# Altium schematic sheet 03_EFR32xG1x_DISC_REF_DES_A00_Efr32Signal.SchDoc
size 420 x 297 mm
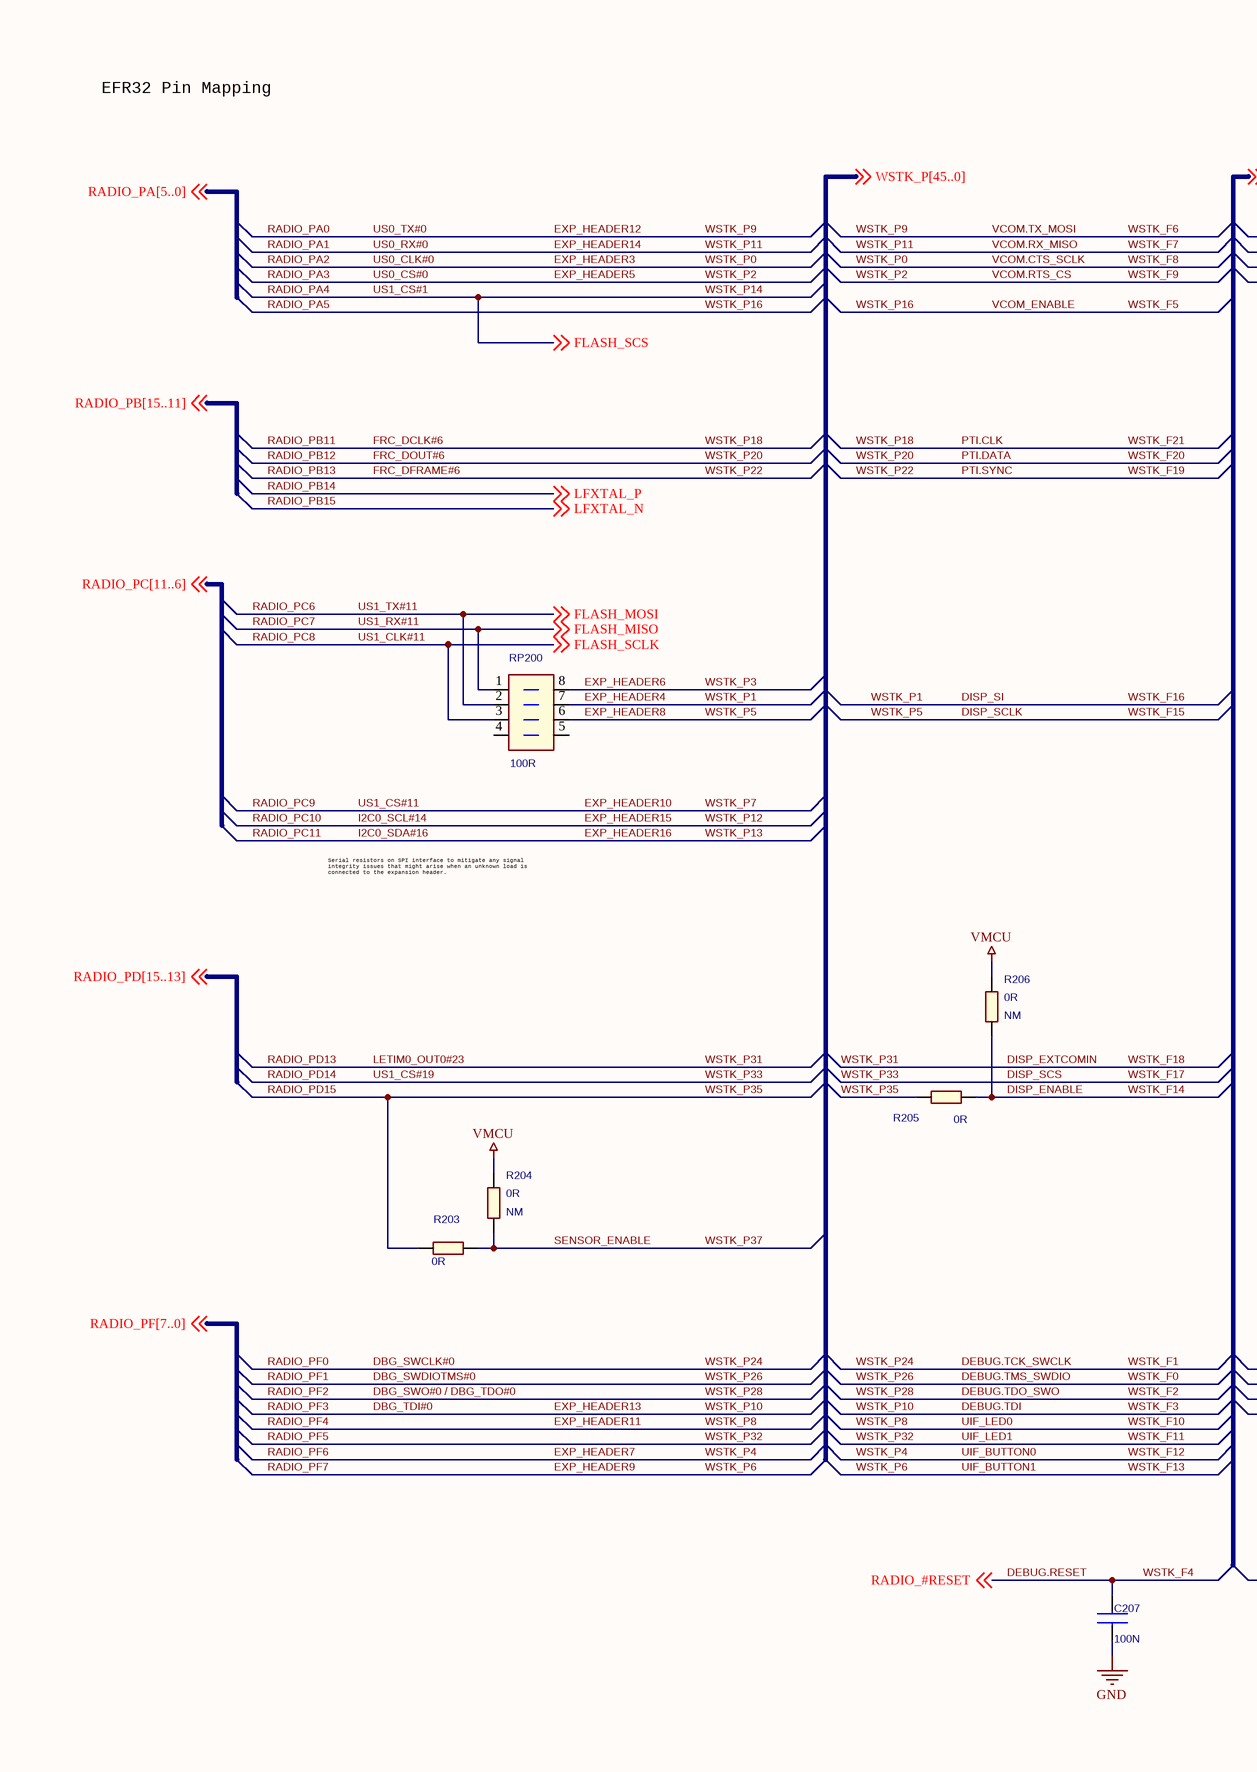
[diagram p0: 03_EFR32xG1x_DISC_REF_DES_A00_Efr32Signal.SchDoc, left]
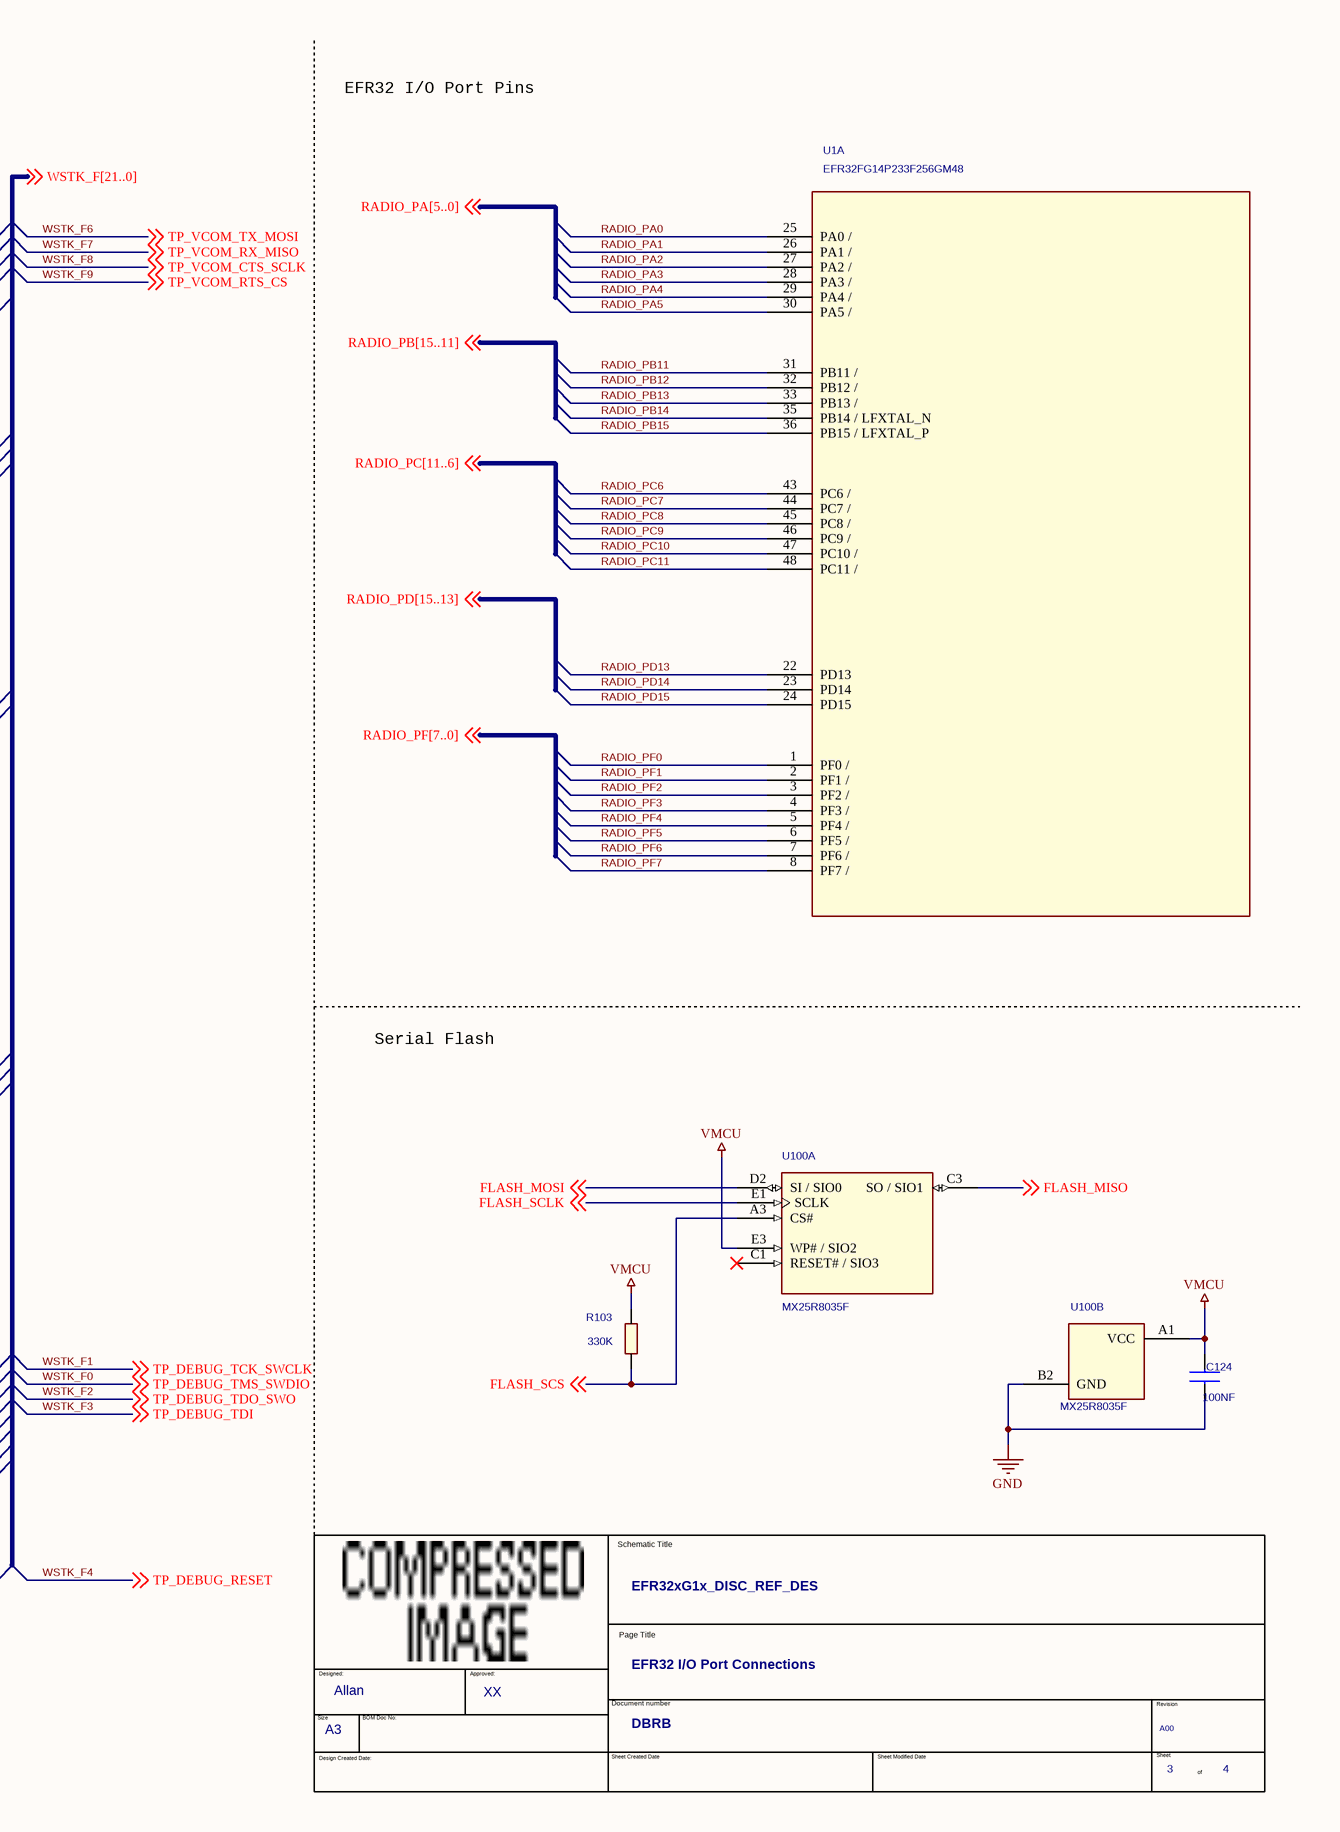
[diagram p1: 03_EFR32xG1x_DISC_REF_DES_A00_Efr32Signal.SchDoc, right]

## Parts
*  OrgAddr2: XX  OrgAddr1: Allan  Page Count: 4  Page Number: 3  Doc: DBRB  Title: EFR32xG1x_DISC_REF_DES  RevCode: A00  Page Size: A3  Page Title: EFR32 I/O Port Connections  (hidden comment: TitleBlock_EnergyMicro_A3)  (graphical)
C124  100NF  [C0402_L]
C207  100N  [C0402_L]
R103  330K  [R0402_L]
R203  0R  [R0402_L]
R204  0R  Not Mounted: NM  [R0402_L]
R205  0R  [R0402_L]
R206  0R  Not Mounted: NM  [R0402_L]
RP200  100R  [RES_MNR04-8]
U1  EFR32FG14P233F256GM48  [QFN48_M050_SQ7.0_EP_SL_L]  (part A of 3)
U100  MX25R8035F  [BGA8_M040_1.24x1.75_WLCSP]  (parts A,B of 2)

## Nets
GND: C124.2 C207.2 U100.B2(GND)
VMCU: C124.1 R103.1 R204.1 R206.1 U100.A1(VCC) U100.E3(WP#_/_SIO2)
DBG_SWCLK#0: U1.1(PF0_/) ; off-sheet TP_DEBUG_TCK_SWCLK  [also labelled DEBUG.TCK_SWCLK, RADIO_PF0, TP_DEBUG_TCK_SWCLK, WSTK_F1, WSTK_P24]
DBG_SWDIOTMS#0: U1.2(PF1_/) ; off-sheet TP_DEBUG_TMS_SWDIO  [also labelled DEBUG.TMS_SWDIO, RADIO_PF1, TP_DEBUG_TMS_SWDIO, WSTK_F0, WSTK_P26]
DBG_SWO#0 / DBG_TDO#0: U1.3(PF2_/) ; off-sheet TP_DEBUG_TDO_SWO  [also labelled DEBUG.TDO_SWO, RADIO_PF2, TP_DEBUG_TDO_SWO, WSTK_F2, WSTK_P28]
DBG_TDI#0: U1.4(PF3_/) ; off-sheet TP_DEBUG_TDI  [also labelled DEBUG.TDI, EXP_HEADER13, RADIO_PF3, TP_DEBUG_TDI, WSTK_F3, WSTK_P10]
DEBUG.RESET: C207.1 ; off-sheet RADIO_#RESET, off-sheet TP_DEBUG_RESET  [also labelled RADIO_#RESET, TP_DEBUG_RESET, WSTK_F4]
DISP_ENABLE: R205.2 R206.2  [also labelled WSTK_F14]
DISP_EXTCOMIN: U1.22(PD13)  [also labelled LETIM0_OUT0#23, RADIO_PD13, WSTK_F18, WSTK_P31]
DISP_SCLK: RP200.6(R16)  [also labelled EXP_HEADER8, WSTK_F15, WSTK_P5]
DISP_SCS: U1.23(PD14)  [also labelled RADIO_PD14, US1_CS#19, WSTK_F17, WSTK_P33]
DISP_SI: RP200.7(R17)  [also labelled EXP_HEADER4, WSTK_F16, WSTK_P1]
EXP_HEADER3: U1.27(PA2_/) ; off-sheet TP_VCOM_CTS_SCLK  [also labelled RADIO_PA2, TP_VCOM_CTS_SCLK, US0_CLK#0, VCOM.CTS_SCLK, WSTK_F8, WSTK_P0]
EXP_HEADER5: U1.28(PA3_/) ; off-sheet TP_VCOM_RTS_CS  [also labelled RADIO_PA3, TP_VCOM_RTS_CS, US0_CS#0, VCOM.RTS_CS, WSTK_F9, WSTK_P2]
EXP_HEADER6: RP200.8(R18)  [also labelled WSTK_P3]
EXP_HEADER7: U1.7(PF6_/)  [also labelled RADIO_PF6, UIF_BUTTON0, WSTK_F12, WSTK_P4]
EXP_HEADER9: U1.8(PF7_/)  [also labelled RADIO_PF7, UIF_BUTTON1, WSTK_F13, WSTK_P6]
EXP_HEADER10: U1.46(PC9_/)  [also labelled RADIO_PC9, US1_CS#11, WSTK_P7]
EXP_HEADER11: U1.5(PF4_/)  [also labelled RADIO_PF4, UIF_LED0, WSTK_F10, WSTK_P8]
EXP_HEADER12: U1.25(PA0_/) ; off-sheet TP_VCOM_TX_MOSI  [also labelled RADIO_PA0, TP_VCOM_TX_MOSI, US0_TX#0, VCOM.TX_MOSI, WSTK_F6, WSTK_P9]
EXP_HEADER14: U1.26(PA1_/) ; off-sheet TP_VCOM_RX_MISO  [also labelled RADIO_PA1, TP_VCOM_RX_MISO, US0_RX#0, VCOM.RX_MISO, WSTK_F7, WSTK_P11]
EXP_HEADER15: U1.47(PC10_/)  [also labelled I2C0_SCL#14, RADIO_PC10, WSTK_P12]
EXP_HEADER16: U1.48(PC11_/)  [also labelled I2C0_SDA#16, RADIO_PC11, WSTK_P13]
FRC_DCLK#6: U1.31(PB11_/)  [also labelled PTI.CLK, RADIO_PB11, WSTK_F21, WSTK_P18]
FRC_DFRAME#6: U1.33(PB13_/)  [also labelled PTI.SYNC, RADIO_PB13, WSTK_F19, WSTK_P22]
FRC_DOUT#6: U1.32(PB12_/)  [also labelled PTI.DATA, RADIO_PB12, WSTK_F20, WSTK_P20]
RADIO_PA4: R103.2 U1.29(PA4_/) U100.A3(CS#) ; off-sheet FLASH_SCS  [also labelled FLASH_SCS, US1_CS#1, WSTK_P14]
RADIO_PA5: U1.30(PA5_/)  [also labelled VCOM_ENABLE, WSTK_F5, WSTK_P16]
RADIO_PB14: U1.35(PB14_/_LFXTAL_N) ; off-sheet LFXTAL_P  [also labelled LFXTAL_P]
RADIO_PB15: U1.36(PB15_/_LFXTAL_P) ; off-sheet LFXTAL_N  [also labelled LFXTAL_N]
RADIO_PC6: RP200.2(R12) U1.43(PC6_/) U100.D2(SI_/_SIO0) ; off-sheet FLASH_MOSI  [also labelled FLASH_MOSI, US1_TX#11]
RADIO_PC7: RP200.1(R11) U1.44(PC7_/) U100.C3(SO_/_SIO1) ; off-sheet FLASH_MISO  [also labelled FLASH_MISO, US1_RX#11]
RADIO_PC8: RP200.3(R13) U1.45(PC8_/) U100.E1(SCLK) ; off-sheet FLASH_SCLK  [also labelled FLASH_SCLK, US1_CLK#11]
RADIO_PD15: R203.1 R205.1 U1.24(PD15)  [also labelled WSTK_P35]
RADIO_PF5: U1.6(PF5_/)  [also labelled UIF_LED1, WSTK_F11, WSTK_P32]
SENSOR_ENABLE: R203.2 R204.2  [also labelled WSTK_P37]

Not connected (* = marked no-connect by the designer): RP200 4(R14) 5(R15); U100 C1(RESET#_/_SIO3)*

## Notes on the sheet
- EFR32 Pin Mapping
- EFR32 I/O Port Pins
- Serial resistors on SPI interface to mitigate any signal
  integrity issues that might arise when an unknown load is
  connected to the expansion header.
- Serial Flash
- (in symbol TitleBlock_EnergyMicro_A3) Schematic Title; Page Title; Designed:; Approved:; Document number; Revision; Size; BOM Doc No:; Design Created Date:; Sheet Created Date; Sheet Modified Date; Sheet; of

## Library data of the parts
C124 C207 = C0402: Rating: 16V; Tolerance: 10%; Technology: X7R
R103 R203-R206 = R0402: Price_1K: 0.005
RP200 = MNR04M0APJ101: Mfg: ROHM; Mfg #: MNR04M0APJ101; Price_1K: 0.0122
U1 = EFR32-DUALBAND-QFN48: MFG: Silicon Labs; MFG #: EFR32FG14P233F256GM48-BR
U100 = MX25R8035: Mfg: Macronix; Mfg #: MX25R8035FBDIL0